# Altium schematic sheet PP 8_14_2012.SchDoc
size 558 x 401 mm; Organization: Carnegie Institution of Washington; DocumentNumber: 1; SheetNumber: 1; SheetTotal: 2; PageSetup: Record=PageOptions|CenterHorizontal=True|CenterVertical=True|PrintScale=0.47|XCorrection=1.00|YCorrection=1.00|PrintKind=1|BorderSize=5000000|LeftOffset=0|BottomOffset=0|Orientation=2|PaperLength=1000|PaperWidth=1000|Scale=100|PaperSource=259|PrintQuality=600|MediaType=1|DitherType=10|PaperKind=Letter (8.5 x 11")|PrintScaleMode=1
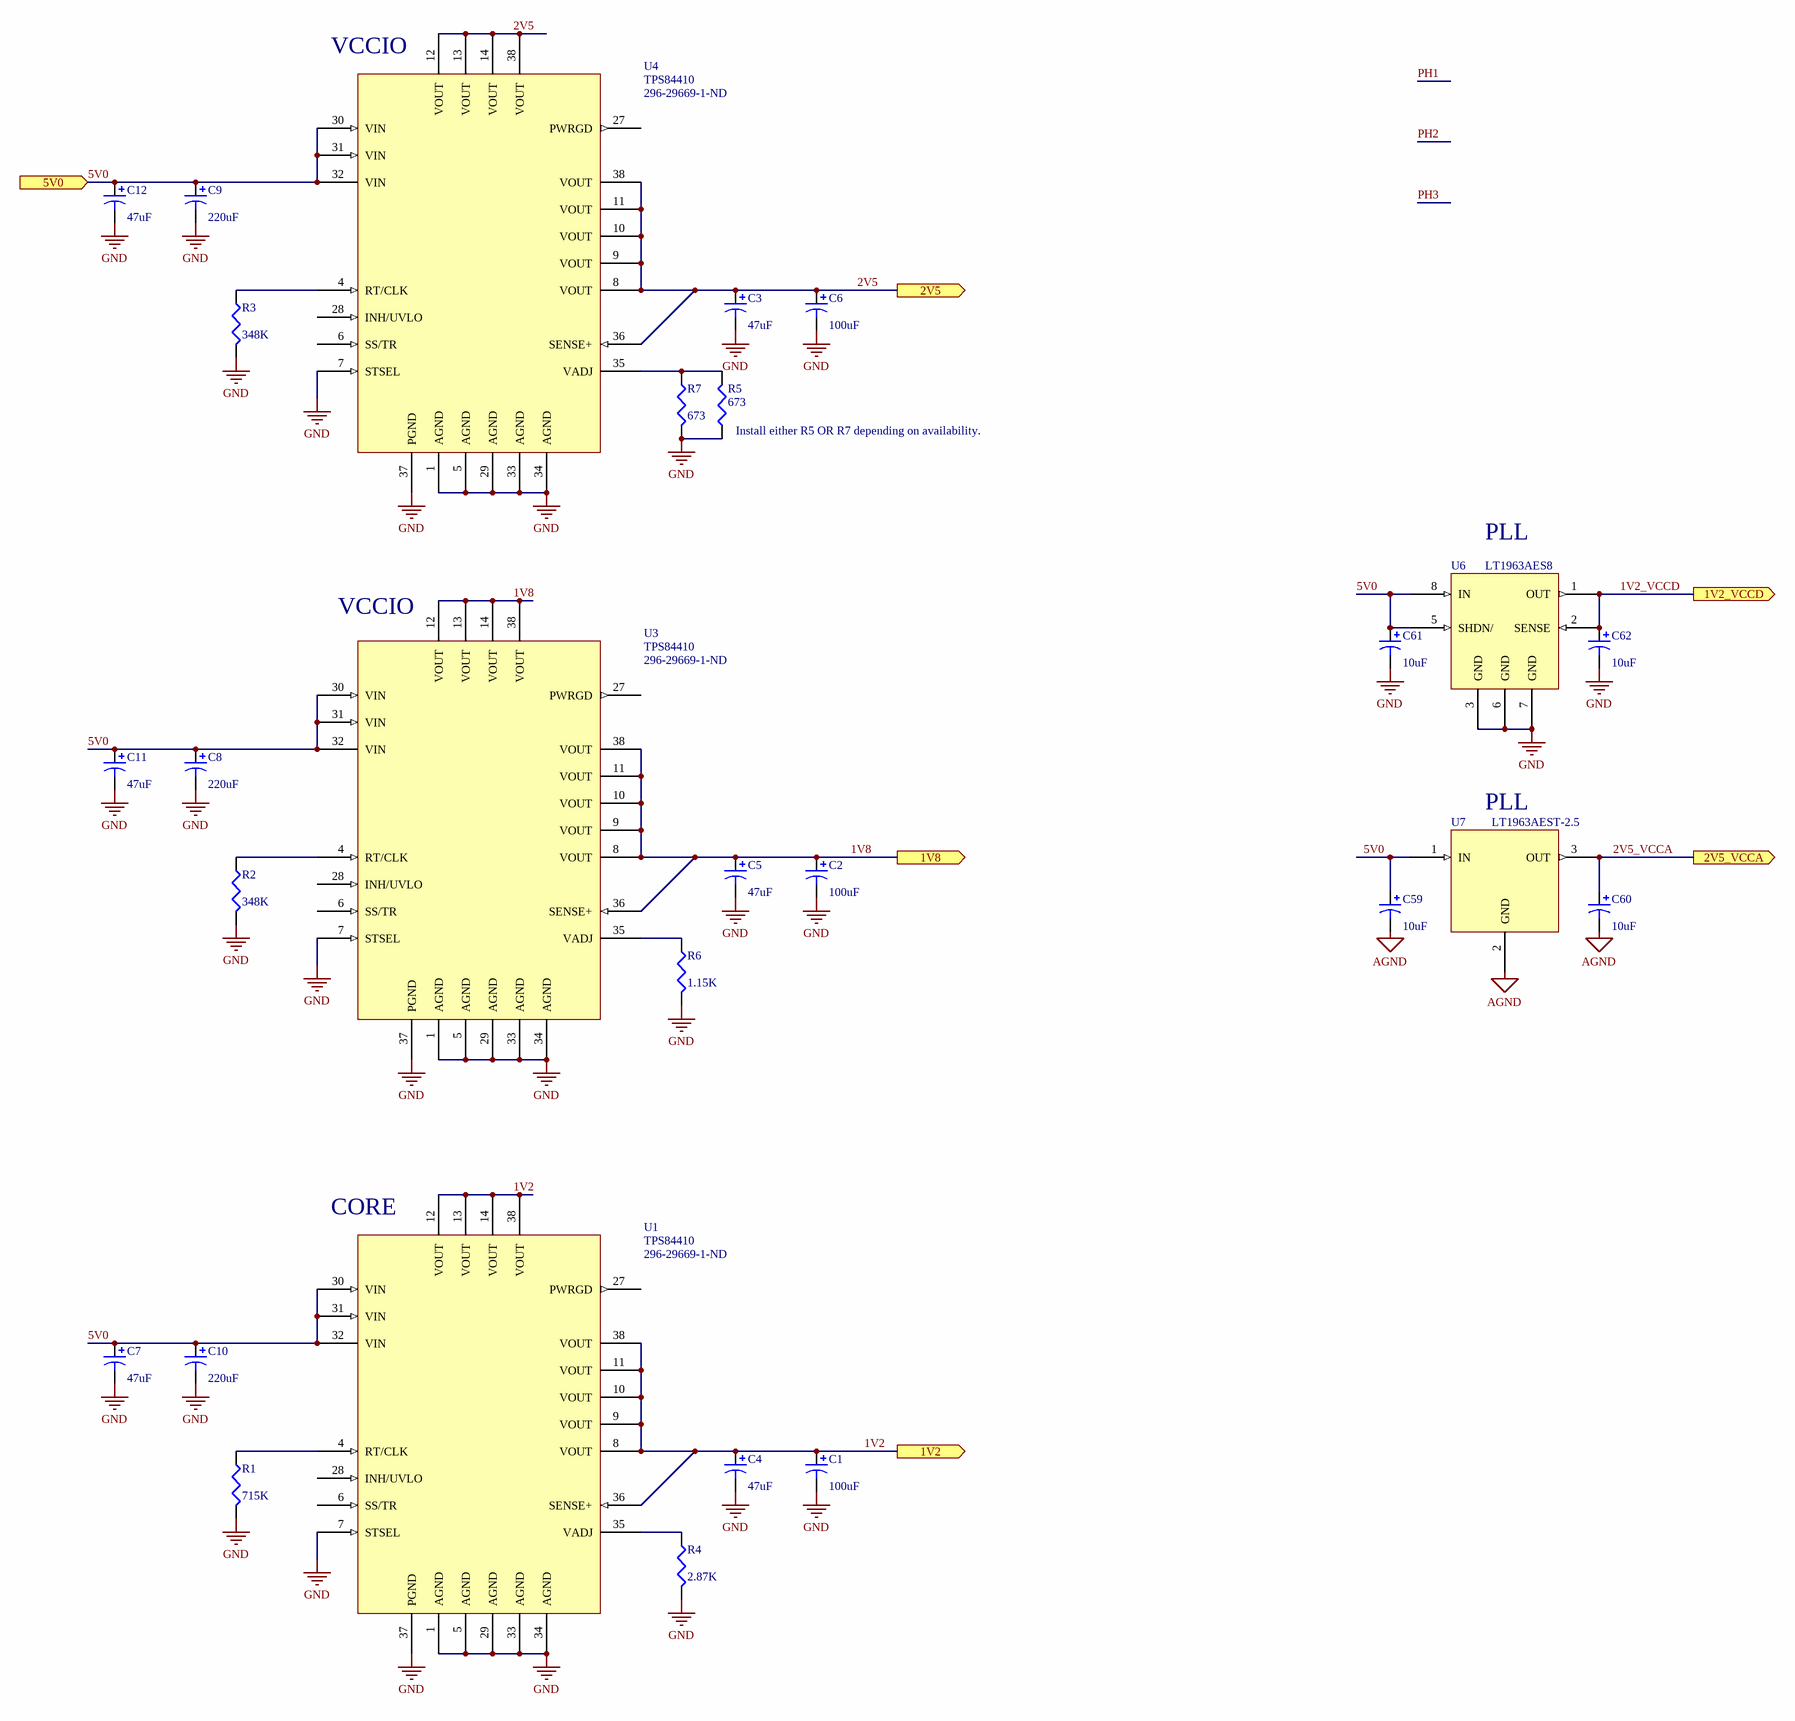
[diagram p0: PP 8_14_2012.SchDoc]

## Parts
C1  value 100uF  [TC3528-1411]  (hidden comment: 100 uF)
C2  value 100uF  [TC3528-1411]  (hidden comment: 100 uF)
C3  value 47uF  [TC3528-1411]  (hidden comment: 100 uF)
C4  value 47uF  [TC3528-1411]  (hidden comment: 47 uF)
C5  value 47uF  [TC3528-1411]  (hidden comment: 47 uF)
C6  value 100uF  [TC3528-1411]  (hidden comment: 47 uF)
C7  value 47uF  [TC3528-1411]  (hidden comment: 220uF)
C8  220uF  [TC3528-1411]
C9  220uF  [TC3528-1411]
C10  value 220uF  [TC3528-1411]  (hidden comment: 47uF)
C11  value 47uF  [TC3528-1411]  (hidden comment: 47 uF)
C12  value 47uF  [TC3528-1411]  (hidden comment: 47 uF)
C59  10uF  [1206]
C60  10uF  [1206]
C61  10uF  [1206]
C62  10uF  [1206]
R1  715K  [J1-0603]
R2  348K  [J1-0603]
R3  348K  [J1-0603]
R4  2.87K  [J1-0603]
R5  673  [RES 0.3 x 0.025]
R6  1.15K  [J1-0603]
R7  673  [J1-0603]
U1  TPS84410  Supplier Part Number 1: 296-29669-1-ND  [QFN-N39]
U3  TPS84410  Supplier Part Number 1: 296-29669-1-ND  [QFN-N39]
U4  TPS84410  Supplier Part Number 1: 296-29669-1-ND  [QFN-N39]
U6  LT1963AES8  [SO8_L]
U7  LT1963AEST-2.5  [SOT-223 LT1963A]

## Ports
1V2 (out), 1V2_VCCD (out), 1V8 (out), 2V5 (out), 2V5_VCCA (out), 5V0 (in)

## Nets
AGND: C59.2 C60.2 U7.2(GND)
GND: C1.2 C2.2 C3.2 C4.2 C5.2 C6.2 C7.2 C8.2 C9.2 C10.2 C11.2 C12.2 C61.2 C62.2 R1.2 R2.2 R3.2 R4.2 R5.1 R6.2 R7.2 U1.1(AGND) U1.5(AGND) U1.7(STSEL) U1.29(AGND) U1.33(AGND) U1.34(AGND) U1.37(PGND) U3.1(AGND) U3.5(AGND) U3.7(STSEL) U3.29(AGND) U3.33(AGND) U3.34(AGND) U3.37(PGND) U4.1(AGND) U4.5(AGND) U4.7(STSEL) U4.29(AGND) U4.33(AGND) U4.34(AGND) U4.37(PGND) U6.3(GND) U6.6(GND) U6.7(GND)
1V2: C1.1 C4.1 U1.8(VOUT) U1.9(VOUT) U1.10(VOUT) U1.11(VOUT) U1.12(VOUT) U1.13(VOUT) U1.14(VOUT) U1.36(SENSE+) U1.38(VOUT) ; port 1V2
1V2_VCCD: C62.1 U6.1(OUT) U6.2(SENSE) ; port 1V2_VCCD
1V8: C2.1 C5.1 U3.8(VOUT) U3.9(VOUT) U3.10(VOUT) U3.11(VOUT) U3.12(VOUT) U3.13(VOUT) U3.14(VOUT) U3.36(SENSE+) U3.38(VOUT) ; port 1V8
2V5: C3.1 C6.1 U4.8(VOUT) U4.9(VOUT) U4.10(VOUT) U4.11(VOUT) U4.12(VOUT) U4.13(VOUT) U4.14(VOUT) U4.36(SENSE+) U4.38(VOUT) ; port 2V5
2V5_VCCA: C60.1 U7.3(OUT) ; port 2V5_VCCA
5V0: C7.1 C8.1 C9.1 C10.1 C11.1 C12.1 C59.1 C61.1 U1.30(VIN) U1.31(VIN) U1.32(VIN) U3.30(VIN) U3.31(VIN) U3.32(VIN) U4.30(VIN) U4.31(VIN) U4.32(VIN) U6.5(SHDN/) U6.8(IN) U7.1(IN) ; port 5V0
NetR1_1: R1.1 U1.4(RT/CLK)
NetR2_1: R2.1 U3.4(RT/CLK)
NetR3_1: R3.1 U4.4(RT/CLK)
NetR4_1: R4.1 U1.35(VADJ)
NetR5_2: R5.2 R7.1 U4.35(VADJ)
NetR6_1: R6.1 U3.35(VADJ)

Not connected (* = marked no-connect by the designer): U1 6(SS/TR) 27(PWRGD) 28(INH/UVLO); U3 6(SS/TR) 27(PWRGD) 28(INH/UVLO); U4 6(SS/TR) 27(PWRGD) 28(INH/UVLO); U6 4(NC)

## Notes on the sheet
- (near U4) VCCIO
- (near R5) Install either R5 OR R7 depending on availability.
- (near U6) PLL
- (near U3) VCCIO
- (near U7) PLL
- (near U1) CORE
- Carnegie Institution of Washington
- 813 Santa Barbara Street
- The Observatories
- PHONE (626) 577-1122               FAX (626) 795-8136
- Pasadena, California 91101
- Title:
- OCIW
- Size:
- Date:
- C
- Scale:
- Drawn By:
- Checked By:
- A. BAGISH
- alanb
- Revision:
- Sheet          of
- File:

## Library data of the parts
C1 C2 C6 = Cap Pol3: Polarized Capacitor (Surface Mount); Description: CAP TANT 100UF 10V 20% 1210; AVX Corporation: TAJB107M010RNJ; Published: 8-Jun-2000; LatestRevisionDate: 29-May-2009; LatestRevisionNote: IPC-7351 Footprint Added.; PackageReference: TC3528-1411; Publisher: Altium Limited; PackageDescription: Chip Capacitor; Digi-Key: 478-5801-6-ND
C3-C5 C7 C11 C12 = Cap Pol3: Polarized Capacitor (Surface Mount); Description: CAP TANT 47UF 10V 10% 1411; Nichicon: F931A476KBA; Published: 8-Jun-2000; LatestRevisionDate: 29-May-2009; LatestRevisionNote: IPC-7351 Footprint Added.; PackageReference: TC3528-1411; Publisher: Altium Limited; PackageDescription: Chip Capacitor; Digi-Key: 493-4143-6-ND
C8-C10 = Cap Pol3: Polarized Capacitor (Surface Mount); Description: CAP TANT 220UF 10V 20% 1210; Nichicon: F950J227MBAAQ2; Published: 8-Jun-2000; LatestRevisionDate: 29-May-2009; LatestRevisionNote: IPC-7351 Footprint Added.; PackageReference: TC3528-1411; Publisher: Altium Limited; PackageDescription: Chip Capacitor; Digi-Key: 493-2918-6-ND
  C8 C9: Value: 220uF
C59-C62 = Cap Pol3: Polarized Capacitor (Surface Mount); Kemet: T491A106M016AT; Description: CAP TANT 10UF 16V 20% 1206; Published: 8-Jun-2000; LatestRevisionDate: 29-May-2009; PackageReference: C0805; Publisher: Altium Limited; PackageDescription: Chip Capacitor; Value: 10uF; Digi-Key: 399-3687-6-ND
R1 R4 = Res3: Resistor; Description: RES 2.87K OHM 1/10W 1% 0603 SMD; Panasonic - ECG: ERJ-3EKF2871V; Published: 8-Jun-2000; LatestRevisionDate: 29-May-2009; LatestRevisionNote: IPC-7351 Footprint Added.; PackageReference: 0603 (1608 Metric); Publisher: Altium Limited; PackageDescription: Chip Resistor
  R1: Value: 715K; Digikey: P715KHCT-ND
  R4: Value: 2.87K; Digikey: P2.87KHCT-ND
R2 R3 = Res3: Resistor; Description: RES 348K OHM 1/10W 1% 0603 SMD; Panasonic - ECG: ERJ-3EKF3483V; Published: 8-Jun-2000; LatestRevisionDate: 29-May-2009; LatestRevisionNote: IPC-7351 Footprint Added.; PackageReference: 0603 (1608 Metric); Publisher: Altium Limited; PackageDescription: Chip Resistor; Value: 348K; Digikey: P348KHCT-ND
R5 R7 = Res3: Resistor; Description: Metal Film Resistors - Through Hole 1/8watt 673ohms .1% 10ppm; Vishay/Dale: PTF56673R00BYEK; Published: 8-Jun-2000; LatestRevisionDate: 29-May-2009; LatestRevisionNote: IPC-7351 Footprint Added.; PackageReference: J1-0603; Publisher: Altium Limited; PackageDescription: 6.35MM AXIAL; Value: 673; Metal Film ResistMOUSER: 71-PTF56673R00BYEK
R6 = Res3: Resistor; Description: RES 1.15K OHM 1/10W 1% 0603 SMD; Panasonic - ECG: ERJ-3EKF1151V; Published: 8-Jun-2000; LatestRevisionDate: 29-May-2009; LatestRevisionNote: IPC-7351 Footprint Added.; PackageReference: J1-0603; Publisher: Altium Limited; PackageDescription: 0603 (1608 Metric); Value: 1.15K; Digikey: P1.15KHCT-ND
U6 = LT1963A
U1 U3 U4 = TPS84410: Supplier 1: Digi-Key